# Altium schematic sheet Sheet1.SchDoc
size A3
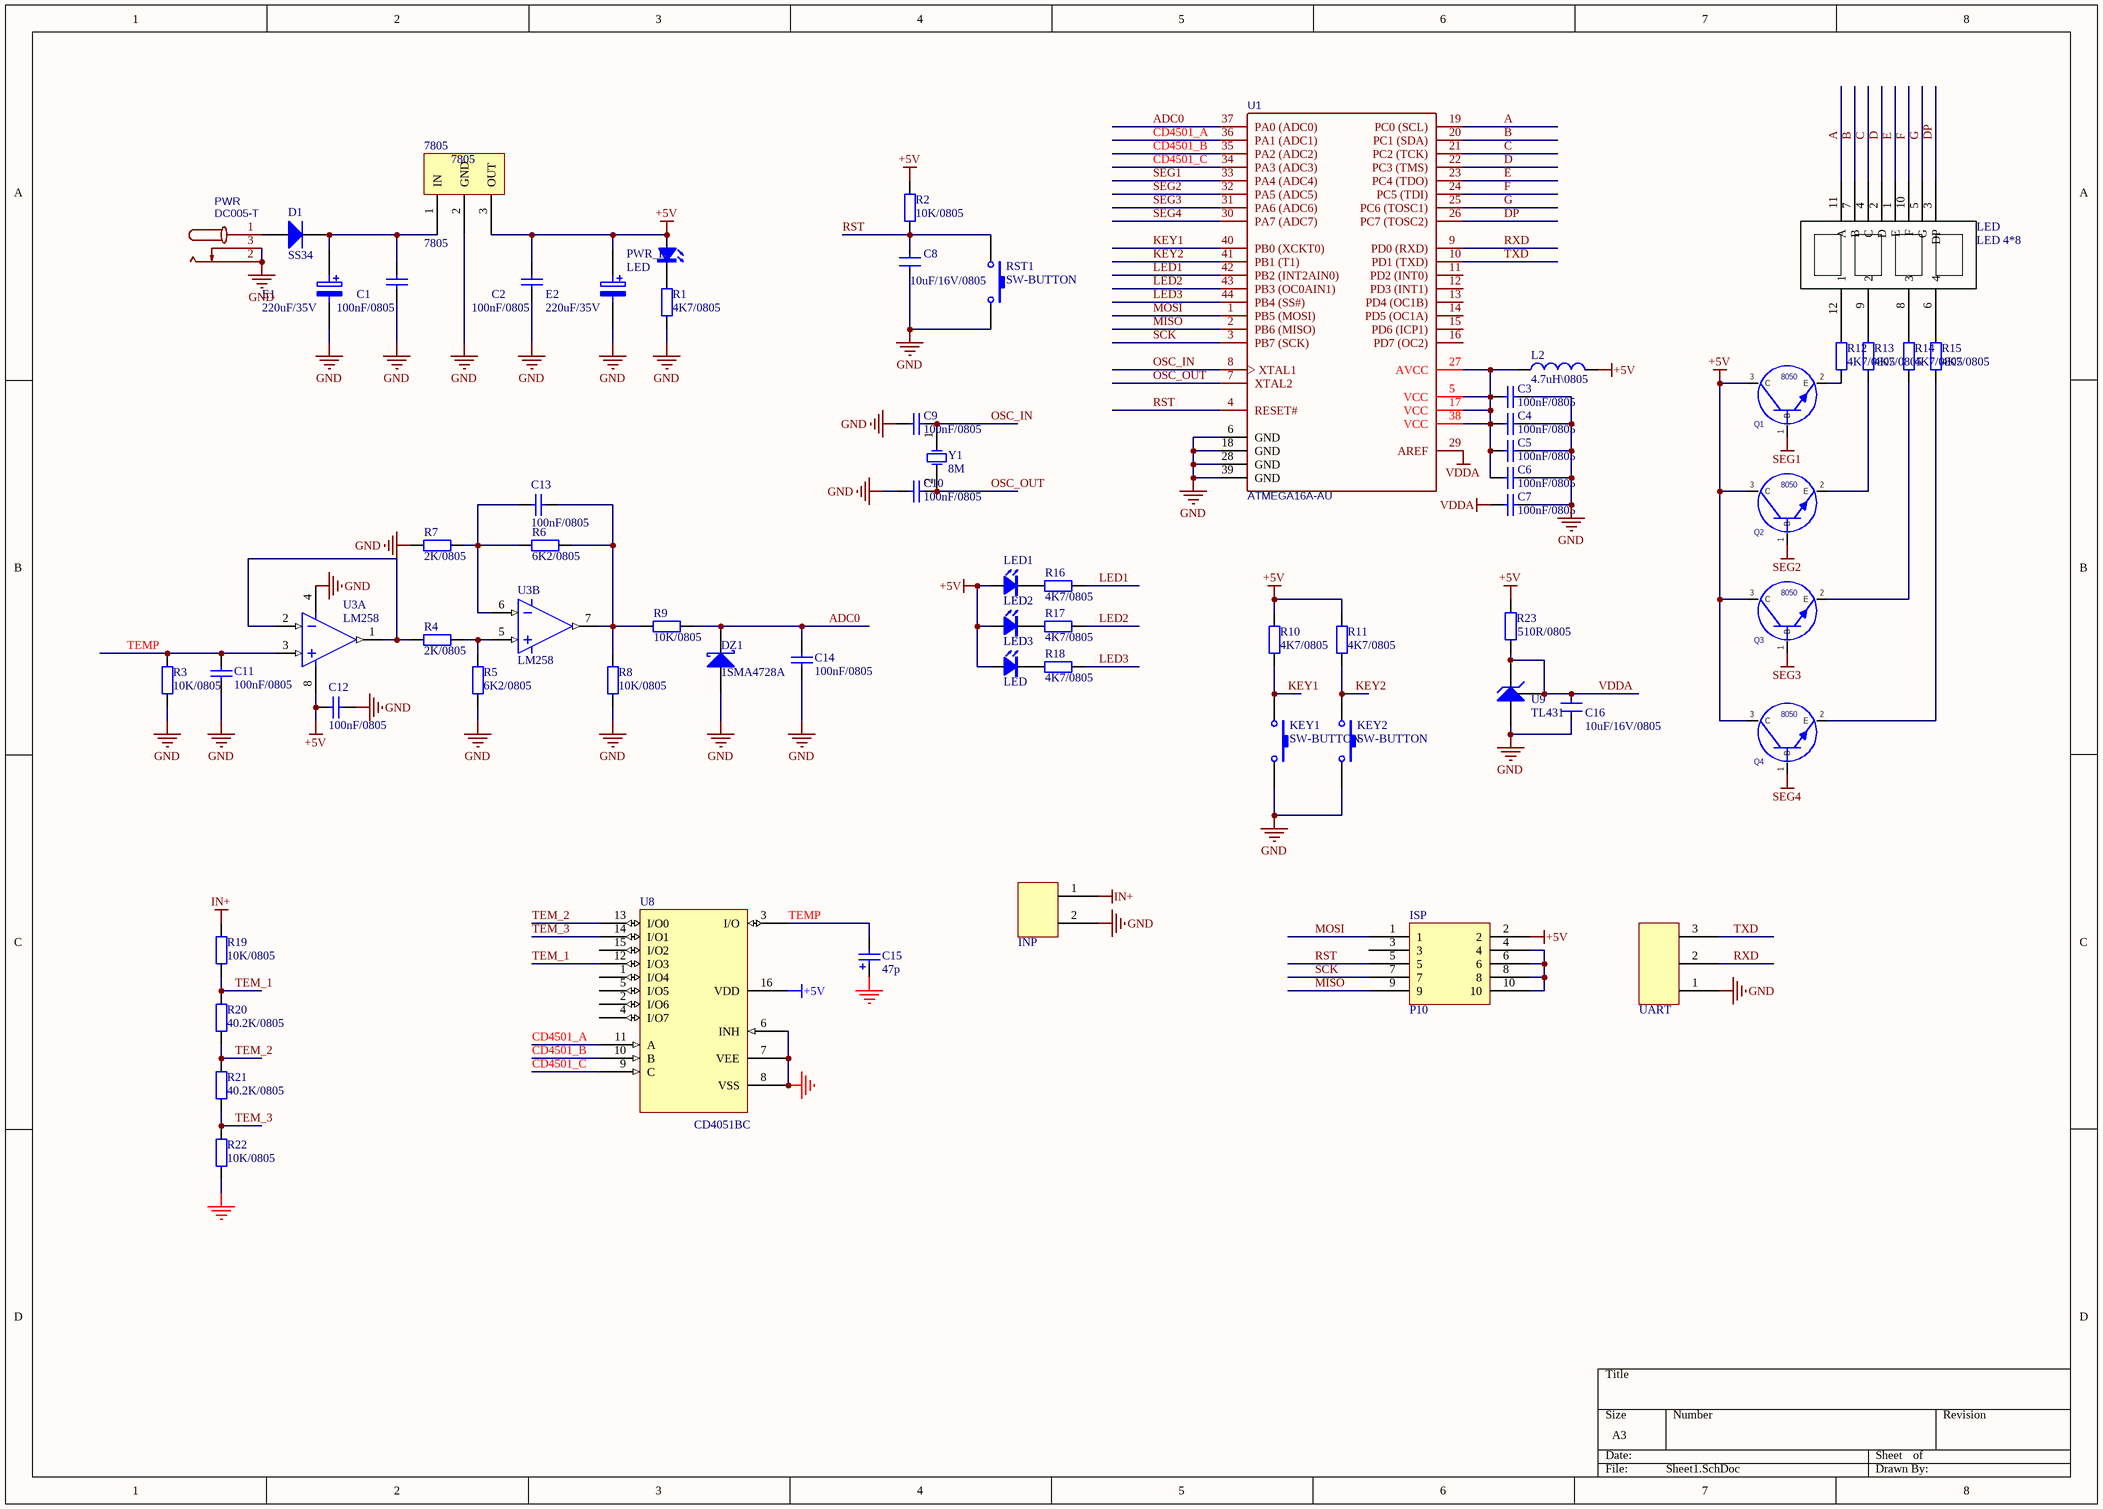
[diagram p0: Sheet1.SchDoc]

## Parts
7805  7805  [7805]
C1  100nF/0805  [C0805]
C2  100nF/0805  [C0805]
C3  100nF/0805  [C0805]
C4  100nF/0805  [C0805]
C5  100nF/0805  [C0805]
C6  100nF/0805  [C0805]
C7  100nF/0805  [C0805]
C8  mark: 10uF/16V/0805  [C0805]  (hidden comment: 10uF)
C9  100nF/0805  [C0805]
C10  100nF/0805  [C0805]
C11  100nF/0805  [C0805]
C12  100nF/0805  [C0805]
C13  100nF/0805  [C0805]
C14  100nF/0805  [C0805]
C15  47p  [C0805]
C16  mark: 10uF/16V/0805  [C0805]  (hidden comment: 10uF)
D1  SS34  [SMA]
DZ1  1SMA4728A  [SMA]
E1  220uF/35V  [CAP-8*10.5MM/CDVT]
E2  220uF/35V  [CAP-8*10.5MM/CDVT]
INP  P  [POWER2]  (value not drawn)
ISP  P10  [IDC-10P]
KEY1  SW-BUTTON  [KEY-SMD_4P-6-6]
KEY2  SW-BUTTON  [KEY-SMD_4P-6-6]
L2  mark: 4.7uH\0805  [0805L]  (hidden comment: Inductor)
LED  LED 4*8  [DIGITAL_LED_0.56]
LED1  LED  [LED0805]
LED2  LED  [LED0805]
LED3  LED  [LED0805]
PWR  DC005-T  [DC005]
PWR_L  LED  [LED0805]
Q1  8050  [SOT-23]
Q2  8050  [SOT-23]
Q3  8050  [SOT-23]
Q4  8050  [SOT-23]
R1  4K7/0805  [R0805]
R2  mark: 10K/0805  [R0805]  (hidden comment: 10K)
R3  mark: 10K/0805  [R0805]  (hidden comment: 10K)
R4  2K/0805  [R0805]
R5  6K2/0805  [R0805]
R6  6K2/0805  [R0805]
R7  2K/0805  [R0805]
R8  10K/0805  [R0805]
R9  10K/0805  [R0805]
R10  4K7/0805  [R0805]
R11  4K7/0805  [R0805]
R12  4K7/0805  [R0805]
R13  4K7/0805  [R0805]
R14  4K7/0805  [R0805]
R15  4K7/0805  [R0805]
R16  4K7/0805  [R0805]
R17  4K7/0805  [R0805]
R18  4K7/0805  [R0805]
R19  10K/0805  [R0805]
R20  40.2K/0805  [R0805]
R21  40.2K/0805  [R0805]
R22  10K/0805  [R0805]
R23  mark: 510R/0805  [R0805]  (hidden comment: 510R)
RST1  SW-BUTTON  [KEY-SMD_4P-6-6]
U1  ATMEGA16A-AU  [TQFP-44]
U3  LM258  [SO-8]  (parts A,B of 2)
U8  CD4051BC  [SO-16]
U9  TL431  [TL431]
UART  P  [POWER3]  (value not drawn)
Y1  8M  [SMD3225]

## Nets
+5V: 7805.3(OUT) C2.2 C12.1 E2.1 ISP.2 L2.2 LED1.1(A) LED2.1(A) LED3.1(A) PWR_L.1(A) Q1.3(C) Q2.3(C) Q3.3(C) Q4.3(C) R2.2 R10.2 R11.2 R23.2 U3.8(V+) U8.16(VDD)
GND: 7805.2(GND) C1.1 C2.1 C3.2 C4.2 C5.2 C6.2 C7.2 C8.2 C9.1 C10.1 C11.1 C12.2 C14.2 C15.1 C16.2 DZ1.1(A) E1.2 E2.2 INP.2 KEY1.2 KEY2.2 PWR.2 PWR.3 R1.2 R3.1 R5.1 R7.2 R8.2 R22.1 RST1.2 U1.6(GND) U1.18(GND) U1.28(GND) U1.39(GND) U3.4(V-) U8.6(INH) U8.7(VEE) U8.8(VSS) U9.3(ANO) UART.1
IN+: INP.1 R19.2
SEG1: Q1.1(B) U1.33(PA4_(ADC4))
SEG2: Q2.1(B) U1.32(PA5_(ADC5))
SEG3: Q3.1(B) U1.31(PA6_(ADC6))
SEG4: Q4.1(B) U1.30(PA7_(ADC7))
VDDA: C7.1 C16.1 R23.1 U1.29(AREF) U9.1(CAT) U9.2(REF)
A: LED.11(A) U1.19(PC0_(SCL))
ADC0: C14.1 DZ1.2(K) R9.2 U1.37(PA0_(ADC0))
B: LED.7(B) U1.20(PC1_(SDA))
C: LED.4(C) U1.21(PC2_(TCK))
CD4501_A: U1.36(PA1_(ADC1)) U8.11(A)
CD4501_B: U1.35(PA2_(ADC2)) U8.10(B)
CD4501_C: U1.34(PA3_(ADC3)) U8.9(C)
D: LED.2(D) U1.22(PC3_(TMS))
DP: LED.3(DP) U1.26(PC7_(TOSC2))
E: LED.1(E) U1.23(PC4_(TDO))
F: LED.10(F) U1.24(PC5_(TDI))
G: LED.5(G) U1.25(PC6_(TOSC1))
KEY1: KEY1.1 R10.1 U1.40(PB0_(XCKT0))
KEY2: KEY2.1 R11.1 U1.41(PB1_(T1))
LED1: R16.2 U1.42(PB2_(INT2AIN0))
LED2: R17.2 U1.43(PB3_(OC0AIN1))
LED3: R18.2 U1.44(PB4_(SS#))
MISO: ISP.9 U1.2(PB6_(MISO))
MOSI: ISP.1 U1.1(PB5_(MOSI))
OSC_IN: C9.2 U1.8(XTAL1) Y1.1(OSC1)
OSC_OUT: C10.2 U1.7(XTAL2) Y1.2(OSC2)
RST: C8.1 ISP.5 R2.1 RST1.1 U1.4(RESET#)
RXD: U1.9(PD0_(RXD)) UART.2
SCK: ISP.7 U1.3(PB7_(SCK))
TEM_1: R19.1 R20.2 U8.12(I/O3)
TEM_2: R20.1 R21.2 U8.13(I/O0)
TEM_3: R21.1 R22.2 U8.14(I/O1)
TEMP: C11.2 C15.2 R3.2 U3.3(+INA) U8.3(I/O)
TXD: U1.10(PD1_(TXD)) UART.3
Net7805_1: 7805.1(IN) C1.2 D1.2(K) E1.1
NetC3_1: C3.1 C4.1 C5.1 C6.1 L2.1 U1.5(VCC) U1.17(VCC) U1.27(AVCC) U1.38(VCC)
NetC13_1: C13.1 R6.2 R7.1 U3.6(-INB)
NetC13_2: C13.2 R6.1 R8.1 R9.1 U3.7(OUTB)
NetD1_1: D1.1(A) PWR.1
NetISP_4: ISP.4 ISP.6 ISP.8 ISP.10
NetLED1_2: LED1.2(K) R16.1
NetLED2_2: LED2.2(K) R17.1
NetLED3_2: LED3.2(K) R18.1
NetLED_6: LED.6(4) R15.2
NetLED_8: LED.8(3) R14.2
NetLED_9: LED.9(2) R13.2
NetLED_12: LED.12(1) R12.2
NetPWR_L_2: PWR_L.2(K) R1.1
NetQ1_2: Q1.2(E) R12.1
NetQ2_2: Q2.2(E) R13.1
NetQ3_2: Q3.2(E) R14.1
NetQ4_2: Q4.2(E) R15.1
NetR4_1: R4.1 U3.1(OUTA) U3.2(-INA)
NetR4_2: R4.2 R5.2 U3.5(+INB)

Not connected (* = marked no-connect by the designer): ISP 3; U1 11(PD2_(INT0)) 12(PD3_(INT1)) 13(PD4_(OC1B)) 14(PD5_(OC1A)) 15(PD6_(ICP1)) 16(PD7_(OC2)); U8 1(I/O4) 2(I/O6) 4(I/O7) 5(I/O5) 15(I/O2)

## Library data of the parts
C1-C7 C9-C14 = Cap Semi: Capacitor (Semiconductor SIM Model); Value: 104; Published: 8-Jun-2000; LatestRevisionDate: 17-Jul-2002; LatestRevisionNote: Re-released for DXP Platform.; PackageReference: C1206; Publisher: Altium Limited
C8 C16 = CAP: 普通小电容
C15 = Cap Pol1: Polarized Capacitor (Radial); Manufacturer: Generic Components; Class: Passive; Published: 08/06/2000; Publisher: Altium Hobart Technology Centre; SubClass: Capacitor; Value: 47p
D1 = Diode 1N914: High Conductance Fast Diode; Published: 8-Jun-2000; LatestRevisionDate: 17-Jul-2002; LatestRevisionNote: Re-released for DXP Platform.; DatasheetVersion: 1997; PackageReference: DO-35; Publisher: Altium Limited; Code_JEDEC: DO-204-AH; ComponentLink1Description: Manufacturer Link; ComponentLink1URL: http://www.fairchildsemi.com/; ComponentLink2Description: Datasheet; ComponentLink2URL: http://www.fairchildsemi.com/ds/1N%2F1N4448.pdf
DZ1 = DZ: Schottky Rectifier; mark: 1SMA4728A
E1 E2 = ELECTRO2: Electrolytic Capacitor
INP = P2
KEY1 KEY2 RST1 = SW-BUTTON: 6*6*5mm轻触开关
L2 = Inductor: Code_IEC: 1005; Published: 8-Jun-2000; LatestRevisionDate: 29-May-2009; LatestRevisionNote: IPC-7351 Footprint Added.; PackageReference: 0402-A; Publisher: Altium Limited; PackageDescription: Chip Inductor; Code_JEITA: 0402
LED = LED4*8
PWR = DC005-T: BOM_Manufacturer: SHOU HAN; Contributor: LCSC; BOM_Supplier: LCSC; BOM_Supplier Part: C431532; BOM_Manufacturer Part: DC005-T; BOM_JLCPCB Part Class: Extended Part; spicePre: D; spiceSymbolName: DC005-T
Q1-Q4 = TRIODE-NPN-MMBT3904: Transistor;NPN;40V;200mA;SOT23;1.1mm;ROHS; Manufacture 1: 长电; Serial Number: 81232000008; PCB DECAL: SOT-23(MMBT3904); Geometry.Height: 1.1mm; Manufacture 1 P/N: MMBT3904
R1-R23 = RES: Resistor; Value: 1K; Published: 8-Jun-2000; LatestRevisionDate: 17-Jul-2002; LatestRevisionNote: Re-released for DXP Platform.; PackageReference: AXIAL-0.4; Publisher: Altium Limited
  R1 R10-R18: mark: 4K7/0805
  R4 R7: mark: 2K/0805
  R5 R6: mark: 6K2/0805
  R8 R9 R19 R22: mark: 10K/0805
  R20 R21: mark: 40.2K/0805
U1 = ATMEGA16A-AU: BOM_Manufacturer: MICROCHIP; BOM_Supplier: LCSC; BOM_Manufacturer Part: ATMEGA16A-AU; BOM_Supplier Part: C5658; BOM_JLCPCB Part Class: Extended Part; spicePre: U; spiceSymbolName: ATMEGA16A-AU
U3 = LM393: 电压比较器
UART = P3
Y1 = XTAL: Crystal Oscillator; Published: 8-Jun-2000; LatestRevisionDate: 17-Jul-2002; LatestRevisionNote: Re-released for DXP Platform.; PackageReference: R38; Publisher: Altium Limited; PackageDescription: Crystal, Thru-Hole; 2 Leads; Body 3.1 x 8.2 mm (Dia.xH)
U9 = TL431: Published: 8-Jun-2000; LatestRevisionDate: 17-Jul-2002; LatestRevisionNote: Re-released for DXP Platform.; PackageReference: DIODE-0.7; Publisher: Altium Limited; PackageDescription: Diode, Thru-Hole; 2 Leads; 0.7 in Pin Spacing; mark: TL431